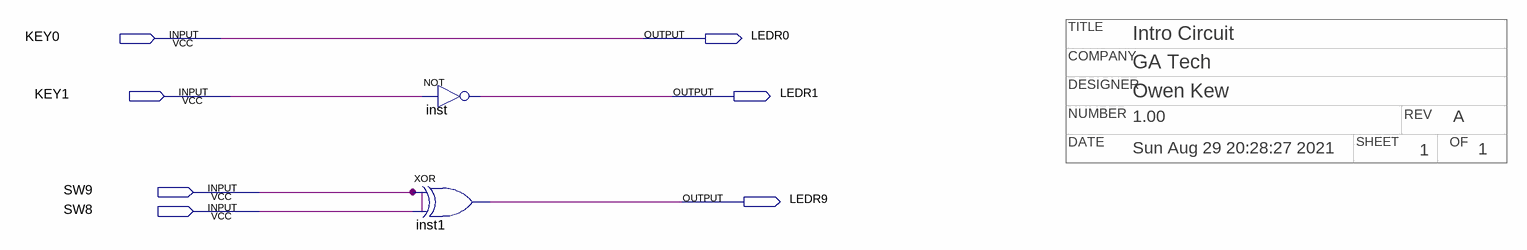
[diagram p0: schematic sheet]
// Quartus schematic LAB0.bdf as structural Verilog: 2 symbols, 7 pins
// Title block: COMPANY: GA Tech; DATE: Sun Aug 29 20:28:27 2021; DESIGNER: Owen Kew; NUMBER: 1.00; OF: 1; REV: A; SHEET: 1; TITLE: Intro Circuit
module LAB0 (
  input  KEY0,
  input  KEY1,
  input  SW9,
  input  SW8,
  output LEDR0,
  output LEDR1,
  output LEDR9
);

  xor inst1 (LEDR9, SW9, SW8);
  not inst (LEDR1, KEY1);

  assign LEDR0 = KEY0;
endmodule
